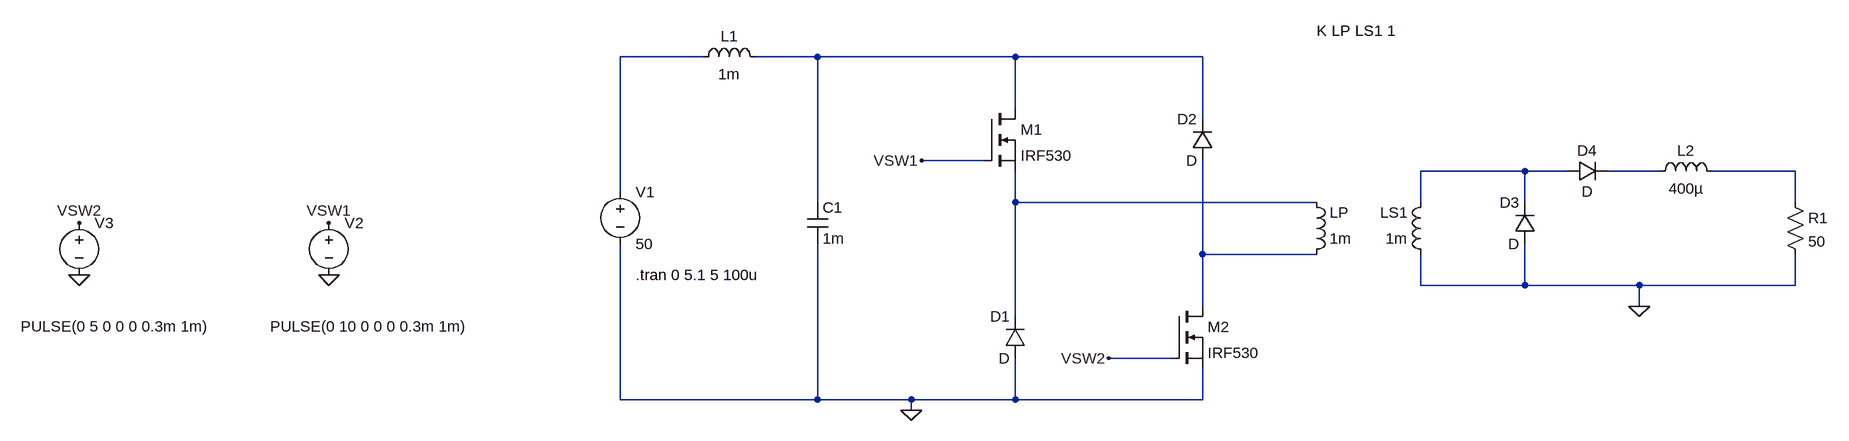
[diagram p0: schematic Draft1.asc]
Draft1.asc, the LTspice schematic file:
Version 4.1
SHEET 1 1944 680
WIRE 208 -96 80 -96
WIRE 384 -96 288 -96
WIRE 688 -96 384 -96
WIRE 976 -96 688 -96
WIRE 688 -16 688 -96
WIRE 976 0 976 -96
WIRE 640 64 544 64
WIRE 1472 80 1312 80
WIRE 1536 80 1472 80
WIRE 1680 80 1600 80
WIRE 1888 80 1760 80
WIRE 80 112 80 -96
WIRE 384 128 384 -96
WIRE 688 128 688 80
WIRE 1152 128 688 128
WIRE 1312 128 1312 80
WIRE 1472 128 1472 80
WIRE 1888 128 1888 80
WIRE 976 208 976 64
WIRE 1152 208 976 208
WIRE 1312 256 1312 208
WIRE 1472 256 1472 192
WIRE 1472 256 1312 256
WIRE 1648 256 1472 256
WIRE 1888 256 1888 208
WIRE 1888 256 1648 256
WIRE 976 288 976 208
WIRE 1648 288 1648 256
WIRE 688 304 688 128
WIRE 928 368 832 368
WIRE 80 432 80 192
WIRE 384 432 384 192
WIRE 384 432 80 432
WIRE 528 432 384 432
WIRE 688 432 688 368
WIRE 688 432 528 432
WIRE 976 432 976 384
WIRE 976 432 688 432
WIRE 528 448 528 432
FLAG -368 240 0
FLAG -368 160 VSW1
FLAG -752 240 0
FLAG -752 160 VSW2
FLAG 528 448 0
FLAG 544 64 VSW1
FLAG 832 368 VSW2
FLAG 1648 288 0
SYMBOL voltage 80 96 R0
WINDOW 123 0 0 Left 0
WINDOW 39 0 0 Left 0
SYMATTR InstName V1
SYMATTR Value 50
SYMBOL voltage -368 144 R0
WINDOW 3 -90 175 Left 2
WINDOW 123 0 0 Left 0
WINDOW 39 0 0 Left 0
SYMATTR InstName V2
SYMATTR Value PULSE(0 10 0 0 0 0.3m 1m)
SYMBOL voltage -752 144 R0
WINDOW 3 -90 175 Left 2
WINDOW 123 0 0 Left 0
WINDOW 39 0 0 Left 0
SYMATTR InstName V3
SYMATTR Value PULSE(0 5 0 0 0 0.3m 1m)
SYMBOL ind 192 -80 R270
WINDOW 0 32 56 VTop 2
WINDOW 3 5 56 VBottom 2
SYMATTR InstName L1
SYMATTR Value 1m
SYMBOL cap 368 128 R0
SYMATTR InstName C1
SYMATTR Value 1m
SYMBOL nmos 640 -16 R0
SYMATTR InstName M1
SYMATTR Value IRF530
SYMBOL nmos 928 288 R0
SYMATTR InstName M2
SYMATTR Value IRF530
SYMBOL diode 704 368 R180
WINDOW 0 24 64 Left 2
WINDOW 3 24 0 Left 2
SYMATTR InstName D1
SYMBOL diode 992 64 R180
WINDOW 0 24 64 Left 2
WINDOW 3 24 0 Left 2
SYMATTR InstName D2
SYMBOL ind 1136 224 M180
WINDOW 0 36 80 Left 2
WINDOW 3 36 40 Left 2
SYMATTR InstName LP
SYMATTR Value 1m
SYMATTR Type ind
SYMBOL ind 1328 224 R180
WINDOW 0 36 80 Left 2
WINDOW 3 36 40 Left 2
SYMATTR InstName LS1
SYMATTR Value 1m
SYMATTR Type ind
SYMBOL diode 1488 192 R180
WINDOW 0 24 64 Left 2
WINDOW 3 24 0 Left 2
SYMATTR InstName D3
SYMBOL diode 1536 96 R270
WINDOW 0 32 32 VTop 2
WINDOW 3 0 32 VBottom 2
SYMATTR InstName D4
SYMBOL ind 1664 96 R270
WINDOW 0 32 56 VTop 2
WINDOW 3 5 56 VBottom 2
SYMATTR InstName L2
SYMATTR Value 400µ
SYMBOL res 1872 112 R0
SYMATTR InstName R1
SYMATTR Value 50
TEXT 104 240 Left 2 !.tran 0 5.1 5 100u
TEXT 1152 -136 Left 2 !K LP LS1 1

The netlist it stands for:
* Draft1.asc
V1 N001 0 50
V2 VSW1 0 PULSE(0 10 0 0 0 0.3m 1m)
V3 VSW2 0 PULSE(0 5 0 0 0 0.3m 1m)
L1 N001 N002 1m
C1 N002 0 1m
M1 N002 VSW1 N006 N006 IRF530
M2 N007 VSW2 0 0 IRF530
D1 0 N006 D
D2 N007 N002 D
LP N007 N006 1m
LS1 0 N003 1m
D3 0 N003 D
D4 N003 N004 D
L2 N004 N005 400µ
R1 N005 0 50
.model D D
.lib standard.dio
.model NMOS NMOS
.model PMOS PMOS
.lib standard.mos
.tran 0 5.1 5 100u
K LP LS1 1
.backanno
.end